# EAGLE schematic current limiter (EAGLE 7.4.0)
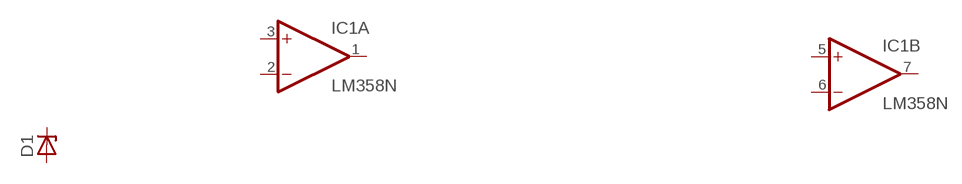
[diagram p0: schematic, sheet 1]

## Parts
D1  ZENER-DIODEZD-2.5  [ZDIO-2.5]
IC1  LM358N  [DIL08]
Unconnected: D1.A D1.C IC1.1(A:OUT) IC1.2(A:-IN) IC1.3(A:+IN) IC1.5(B:+IN) IC1.6(B:-IN) IC1.7(B:OUT)

## Power pins joined to a net without a drawn wire
V+: IC1.8(P:V+)
V-: IC1.4(P:V-)

## Library data of the parts
D1 = diode:ZENER-DIODE: Z-Diode
IC1 = linear:LM358: OP AMP also LM158; LM258; LM2904 Source: http://cache.national.com/ds/LM/LM158.pdf